# Altium schematic sheet PIC32MZ.SchDoc
size B; SheetNumber: 2; SheetTotal: 7
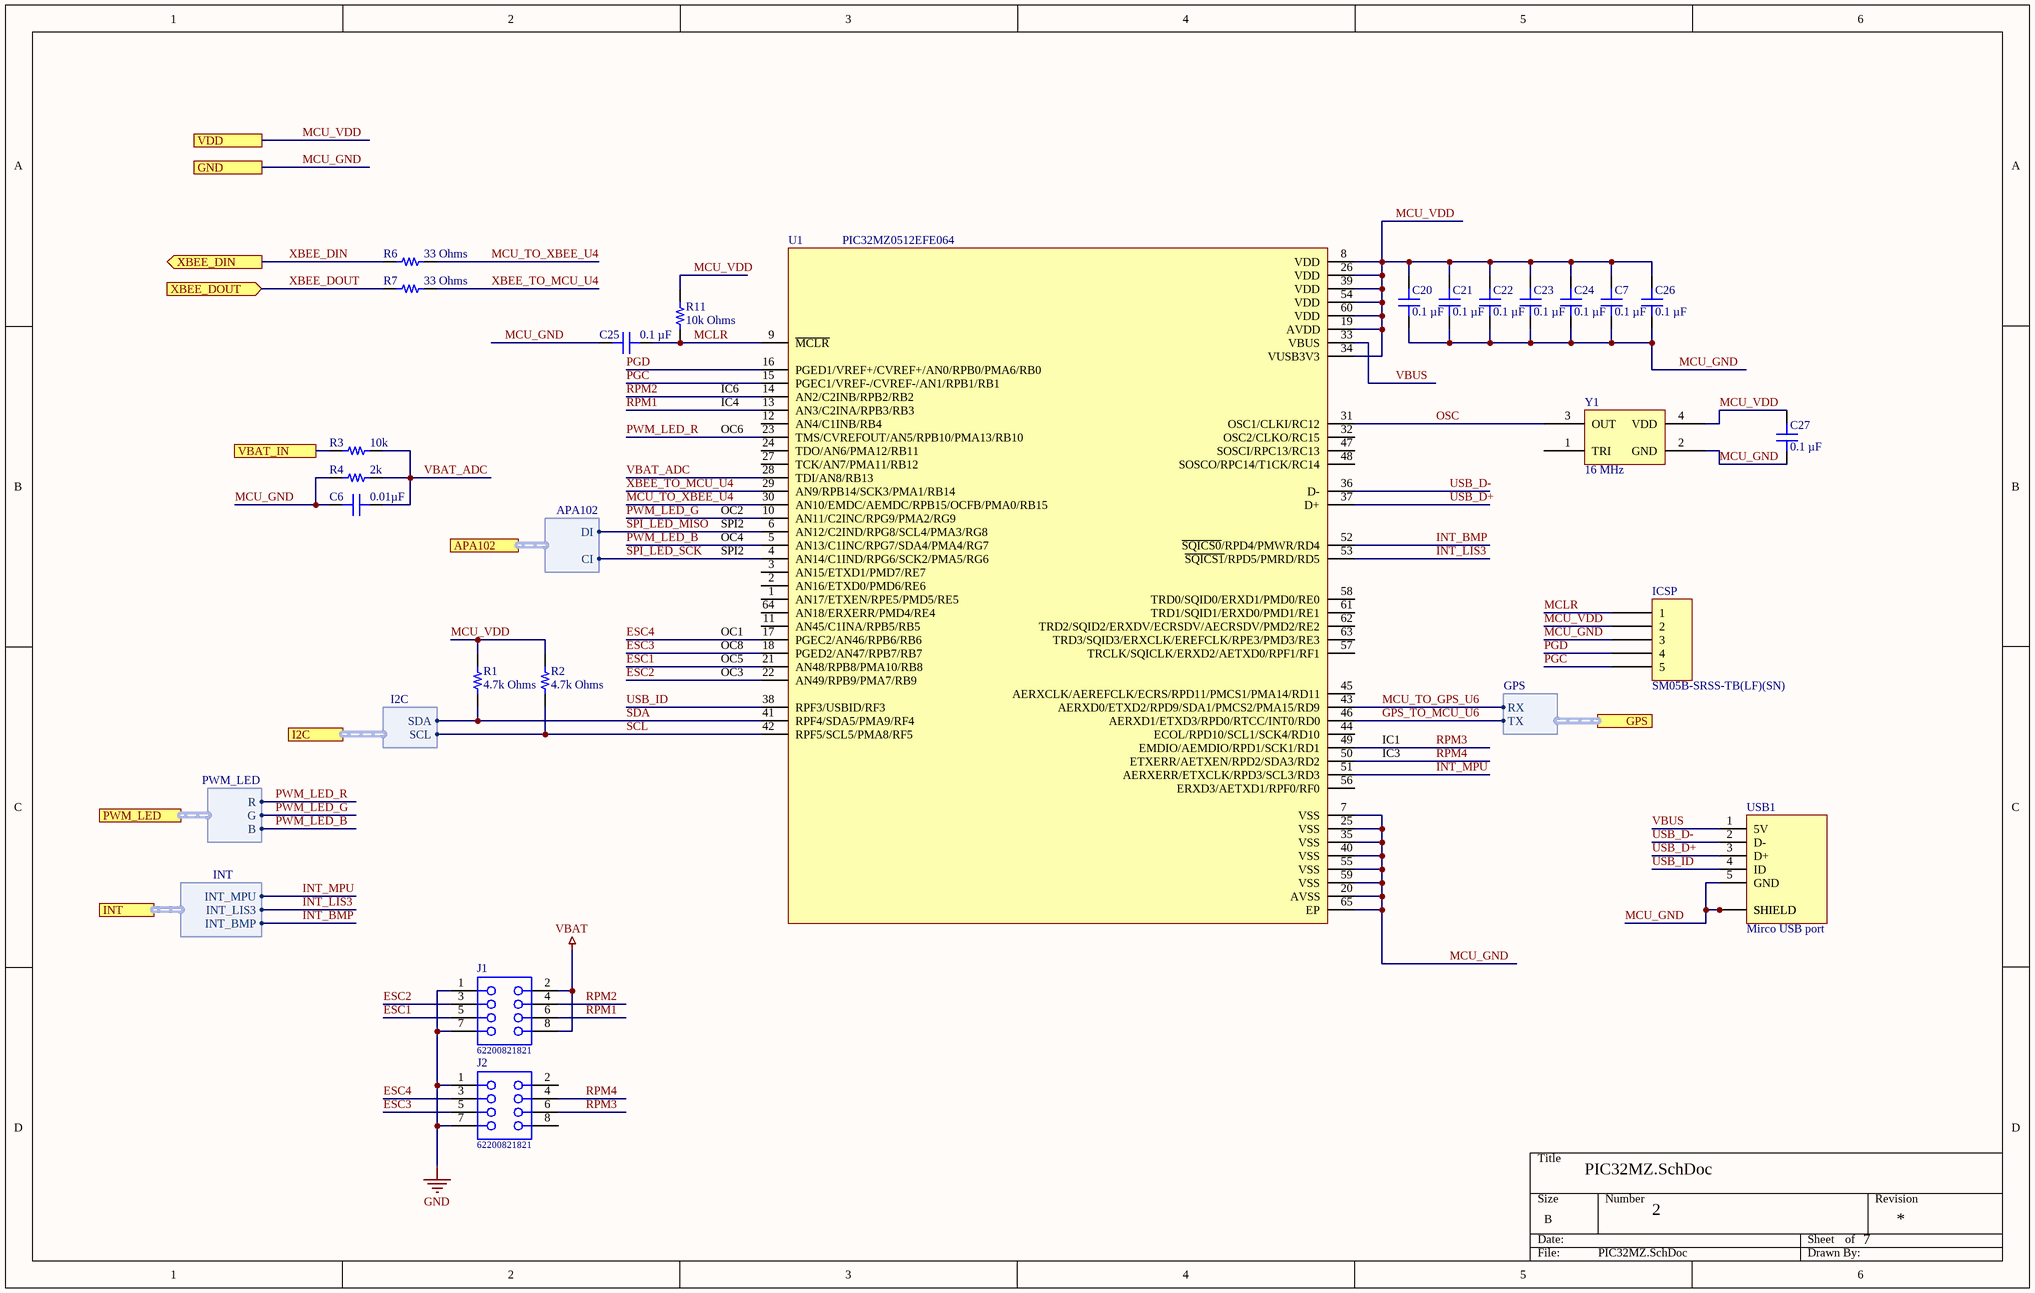
[diagram p0: PIC32MZ.SchDoc]

## Parts
C6  0.01µF  [CAP 0603_1608]
C7  0.1 µF  [CAP 0402_1005]
C20  0.1 µF  [CAP 0402_1005]
C21  0.1 µF  [CAP 0402_1005]
C22  0.1 µF  [CAP 0402_1005]
C23  0.1 µF  [CAP 0402_1005]
C24  0.1 µF  [CAP 0402_1005]
C25  0.1 µF  [CAP 0402_1005]
C26  0.1 µF  [CAP 0402_1005]
C27  0.1 µF  [CAP 0402_1005]
ICSP  SM05B-SRSS-TB(LF)(SN)  [JST SM05B-SRSS-TB]
J1  62200821821  [62200821821]
J2  62200821821  [62200821821]
R1  4.7k Ohms  [RES 0402_1005]
R2  4.7k Ohms  [RES 0402_1005]
R3  10k  [RES 0603_1608]
R4  2k  [RES 0603_1608]
R6  33 Ohms  [RES 0402_1005]
R7  33 Ohms  [RES 0402_1005]
R11  10k Ohms  [RES 0402_1005]
U1  PIC32MZ0512EFE064  [QFN50P900X900X100-65N]
USB1  Mirco USB port  [AMPHENOL_10118194-0001LF]
Y1  16 MHz  [ABRACON ASE]

## Ports
APA102 (harness APA102), GND, GPS (harness GPS), I2C (harness I2C), INT (harness INT), PWM_LED (harness PWM_LED), VBAT_IN, VDD, XBEE_DIN (out), XBEE_DOUT (in)

## Harnesses
I2C: SDA, SCL
APA102: DI, CI
GPS: RX, TX
PWM_LED: R, B, G
INT: INT_MPU, INT_BMP, INT_LIS3

## Nets
GND: J1.1 J1.7 J2.1 J2.7
VBAT: J1.2 J1.8
ESC1: J1.5 U1.21(AN48/RPB8/PMA10/RB8)
ESC2: J1.3 U1.22(AN49/RPB9/PMA7/RB9)
ESC3: J2.5 U1.18(PGED2/AN47/RPB7/RB7)
ESC4: J2.3 U1.17(PGEC2/AN46/RPB6/RB6)
GPS_TO_MCU_U6: U1.46(AERXD1/ETXD3/RPD0/RTCC/INT0/RD0) ; port GPS.TX
INT_BMP: U1.52(~{SQICS0}/RPD4/PMWR/RD4) ; port INT.INT_BMP
INT_LIS3: U1.53(~{SQICS1}/RPD5/PMRD/RD5) ; port INT.INT_LIS3
INT_MPU: U1.51(AERXERR/ETXCLK/RPD3/SCL3/RD3) ; port INT.INT_MPU
MCLR: C25.1 ICSP.1 R11.1 U1.9(~{MCLR})
MCU_GND: C6.2 C7.1 C20.1 C21.1 C22.1 C23.1 C24.1 C25.2 C26.1 C27.1 ICSP.3 R4.1 U1.7(VSS) U1.20(AVSS) U1.25(VSS) U1.35(VSS) U1.40(VSS) U1.55(VSS) U1.59(VSS) U1.65(EP) USB1.5(GND) USB1.S1(SHIELD) USB1.S2(SHIELD) USB1.S3(SHIELD) USB1.S4(SHIELD) USB1.S5(SHIELD) USB1.S6(SHIELD) Y1.2(GND) ; port GND
MCU_TO_GPS_U6: U1.43(AERXD0/ETXD2/RPD9/SDA1/PMCS2/PMA15/RD9) ; port GPS.RX
MCU_TO_XBEE_U4: R6.2 U1.30(AN10/EMDC/AEMDC/RPB15/OCFB/PMA0/RB15)
MCU_VDD: C7.2 C20.2 C21.2 C22.2 C23.2 C24.2 C26.2 C27.2 ICSP.2 R1.2 R2.2 R11.2 U1.8(VDD) U1.19(AVDD) U1.26(VDD) U1.34(VUSB3V3) U1.39(VDD) U1.54(VDD) U1.60(VDD) Y1.4(VDD) ; port VDD
OSC: U1.31(OSC1/CLKI/RC12) Y1.3(OUT)
PGC: ICSP.5 U1.15(PGEC1/VREF-/CVREF-/AN1/RPB1/RB1)
PGD: ICSP.4 U1.16(PGED1/VREF+/CVREF+/AN0/RPB0/PMA6/RB0)
PWM_LED_B: U1.5(AN13/C1INC/RPG7/SDA4/PMA4/RG7) ; port PWM_LED.B
PWM_LED_G: U1.10(AN11/C2INC/RPG9/PMA2/RG9) ; port PWM_LED.G
PWM_LED_R: U1.23(TMS/CVREFOUT/AN5/RPB10/PMA13/RB10) ; port PWM_LED.R
RPM1: J1.6 U1.13(AN3/C2INA/RPB3/RB3)
RPM2: J1.4 U1.14(AN2/C2INB/RPB2/RB2)
RPM3: J2.6 U1.49(EMDIO/AEMDIO/RPD1/SCK1/RD1)
RPM4: J2.4 U1.50(ETXERR/AETXEN/RPD2/SDA3/RD2)
SCL: R2.1 U1.42(RPF5/SCL5/PMA8/RF5) ; port I2C.SCL
SDA: R1.1 U1.41(RPF4/SDA5/PMA9/RF4) ; port I2C.SDA
SPI_LED_MISO: U1.6(AN12/C2IND/RPG8/SCL4/PMA3/RG8) ; port APA102.DI
SPI_LED_SCK: U1.4(AN14/C1IND/RPG6/SCK2/PMA5/RG6) ; port APA102.CI
USB_D+: U1.37(D+) USB1.3(D+)
USB_D-: U1.36(D-) USB1.2(D-)
USB_ID: U1.38(RPF3/USBID/RF3) USB1.4(ID)
VBAT_ADC: C6.1 R3.1 R4.2 U1.28(TDI/AN8/RB13)
VBAT_IN: R3.2 ; port VBAT_IN
VBUS: U1.33(VBUS) USB1.1(5V)
XBEE_DIN: R6.1 ; port XBEE_DIN
XBEE_DOUT: R7.1 ; port XBEE_DOUT
XBEE_TO_MCU_U4: R7.2 U1.29(AN9/RPB14/SCK3/PMA1/RB14)

Not connected (* = marked no-connect by the designer): J2 2 8; U1 1(AN17/ETXEN/RPE5/PMD5/RE5) 2(AN16/ETXD0/PMD6/RE6) 3(AN15/ETXD1/PMD7/RE7) 11(AN45/C1INA/RPB5/RB5) 12(AN4/C1INB/RB4) 24(TDO/AN6/PMA12/RB11) 27(TCK/AN7/PMA11/RB12) 32(OSC2/CLKO/RC15) 44(ECOL/RPD10/SCL1/SCK4/RD10) 45(AERXCLK/AEREFCLK/ECRS/RPD11/PMCS1/PMA14/RD11) 47(SOSCI/RPC13/RC13) 48(SOSCO/RPC14/T1CK/RC14) 56(ERXD3/AETXD1/RPF0/RF0) 57(TRCLK/SQICLK/ERXD2/AETXD0/RPF1/RF1) 58(TRD0/SQID0/ERXD1/PMD0/RE0) 61(TRD1/SQID1/ERXD0/PMD1/RE1) 62(TRD2/SQID2/ERXDV/ECRSDV/AECRSDV/PMD2/RE2) 63(TRD3/SQID3/ERXCLK/EREFCLK/RPE3/PMD3/RE3) 64(AN18/ERXERR/PMD4/RE4); Y1 1(TRI)

## Notes on the sheet
- (near U1) IC4
- IC6
- (near U1) OC6
- (near U1) SPI2
- (near U1) OC2
- (near U1) OC4
- (near U1) OC1
- (near U1) OC5
- (near U1) OC3
- (near U1) OC8
- IC1
- IC3

## Library data of the parts
C6 = GCG188R92A104KA03D: CAP CER 0.1UF 100V 0603 EPOXY; Manufacturer: Murata Electronics; Capacitance: 0.1µF; Temperature Coefficient: X8R; Tolerance: ±10%; Part Number: GCG188R92A104KA03D; Value: 0.01µF; Applications: Automotive; ComponentLink1Description: Datasheet; ComponentLink1URL: https://search.murata.co.jp/Ceramy/image/img/A01X/G101/ENG/GCG188R92A104KA03-01.pdf; ComponentLink2Description: DigiKey Link; ComponentLink2URL: http://digikey.com/product-detail/en/murata-electronics/GCG188R92A104KA03D/490-18197-1-ND/9867926; Device Package: 0603 (1608 Metric); Features: Epoxy Mountable; LastUpdated: 21-Jan-20 12:01:59 AM; Lifecycle Status: Active; Minimum Order: 1; Mounting Type: Surface Mount, MLCC, Epoxy; Operating Temperature: -55°C ~ 150°C; Package / Case: 0603 (1608 Metric); Packaging: TapeAndReel; PartId: 9025; Part Status: Active; Price: 0.07; Ratings: AEC-Q200; Series: GCG; Size / Dimension: 0.063" L x 0.031" W (1.60mm x 0.80mm); Supplier 1: DigiKey; Supplier Part Number 1: 490-18197-1-ND; Thickness (Max): 0.035" (0.90mm); Voltage - Rated: 100V
C7 C20-C27 = C0402C104K4RACAUTO: CAP CER 0.1UF 16V X7R 0402; manufacturer: KEMET; Tolerance: ±10%; Part Number: C0402C104K4RACAUTO; Value: 0.1 µF; Applications: Automotive, Bypass, Decoupling; Capacitance: 0.1 µF; componentlink1description: Datasheet; componentlink1url: https://api.kemet.com/component-edge/download/specsheet/C0402C104K4RACAUTO.pdf; componentlink2description: DigiKey Link; componentlink2url: https://www.digikey.com/en/products/detail/kemet/C0402C104K4RACAUTO/3314827; Device Package: 0402 (1005 Metric); lastupdated: 8/14/2022 9:05:51 PM; Lifecycle Status: Active; Minimum Order: 1; Mounting Type: Surface Mount, MLCC; Operating Temperature: -55°C ~ 125°C; Package / Case: 0402 (1005 Metric); packaging: TapeAndReel; partid: 3024; Part Status: Active; price: 0.01; Ratings: AEC-Q200; series: SMD Auto X7R; Size / Dimension: 0.039" L x 0.020" W (1.00mm x 0.50mm); Supplier 1: DigiKey; Supplier Part Number 1: 399-6828-1-ND; Temperature Coefficient: X7R; Thickness (Max): 0.022" (0.55mm); Voltage - Rated: 16V
ICSP = SM05B-SRSS-TB(LF)(SN): CONN HEADER SMD R/A 5POS 1MM; Manufacturer: JST Sales America Inc.; Current Rating (Amps): 0.7A; Material Flammability Rating: UL94 V-0; Number of Positions: 5; Number of Positions Loaded: All; Pitch - Mating: 0.039" (1.00mm); Shrouding: Shrouded - 4 Wall; Style: Board to Cable/Wire; Voltage Rating: 50V; Part Number: SM05B-SRSS-TB(LF)(SN); ComponentLink1Description: Datasheet; ComponentLink1URL: http://www.jst-mfg.com/product/pdf/eng/eSH.pdf; ComponentLink2Description: DigiKey Link; ComponentLink2URL: http://digikey.com/product-detail/en/jst-sales-america-inc/SM05B-SRSS-TB-LF-SN/455-1805-1-ND/926876; Connector Type: Header; Contact Finish - Mating: Tin; Contact Finish - Post: Tin; Contact Material: Copper Alloy; Contact Shape: Square; Contact Type: Male Pin; Fastening Type: Push-Pull; Features: Solder Retention; Insulation Color: Natural; Insulation Height: 0.114" (2.90mm); Insulation Material: Polyamide (PA), Nylon; LastUpdated: 1/12/2020 11:42:04 PM; Lifecycle Status: Active; Minimum Order: 1; Mounting Type: Surface Mount, Right Angle; Number of Rows: 1; Operating Temperature: -25°C ~ 85°C; Packaging: TapeAndReel; PartId: 63; Part Status: Active; Price: 0.32; Series: SR; Supplier 1: DigiKey; Supplier Part Number 1: 455-1805-1-ND; Termination: Solder
J1 J2 = 62200821821: WR-PHD Socket Header, THT, pitch 1.27mm, Dual Row, Vertical, 8p; Manufacturer: Wurth Elektronik; Pin Number: 8; Rated Current: 1A; Working Voltage: 250VAC; Withstanding Voltage: 500VAC; Contact Resistance: 20mOhm; System: Connector; ComponentLink1Description: Manufacturer; ComponentLink1URL: http://www.we-online.de; ComponentLink2Description: Datasheet; ComponentLink2URL: https://www.we-online.com/catalog/datasheet/62200821821.pdf; Manufacturer Part Number: 62200821821; Published Date: May 2020; Pitch: 1.27mm; Operating Temperature: -40 to +105degC; Mounting Technology: THT; Packaging: Tube; Gender: Socket Header; Row Number: Dual; Orientation: Vertical
R1 R2 R6 R7 R11 = CRCW0402330RJNEDC: RES 330 OHM 5% 1/16W 0402; Manufacturer: Vishay Dale; Power (Watts): 0.063W, 1/16W; Resistance: 330 Ohms; Temperature Coefficient: ±200ppm/°C; Part Number: CRCW0402330RJNEDC; ComponentLink1Description: Datasheet; ComponentLink1URL: http://www.vishay.com/docs/28773/crcwce3.pdf; ComponentLink2Description: DigiKey Link; ComponentLink2URL: https://www.digikey.com/en/products/detail/vishay-dale/CRCW0402330RJNEDC/7928545; Composition: Thick Film; Device Package: 0402 (1005 Metric); Height - Seated (Max): 0.014" (0.35mm); LastUpdated: 8/14/2022 9:23:31 PM; Lifecycle Status: Active; Minimum Order: 1; Number of Terminations: 2; Operating Temperature: -55°C ~ 155°C; Package / Case: 0402 (1005 Metric); Packaging: CutTape; PartId: 15989; Part Status: Active; Price: 0.01; Series: CRCW-C; Size / Dimension: 0.039" L x 0.020" W (1.00mm x 0.50mm); Supplier 1: DigiKey; Supplier Part Number 1: 541-4123-1-ND; Supplier Device Package: 0402; Tolerance: ±5%
  R1 R2: Value: 4.7k Ohms
  R6 R7: Value: 33 Ohms
  R11: Value: 10k Ohms
R3 R4 = ERJ-3EKF21R5V: RES SMD 21.5 OHM 1% 1/10W 0603; Manufacturer: Panasonic Electronic Components; Power (Watts): 0.1W, 1/10W; Resistance: 21.5 Ohms; Temperature Coefficient: ±100ppm/°C; Part Number: ERJ-3EKF21R5V; ComponentLink1Description: Datasheet; ComponentLink1URL: https://industrial.panasonic.com/cdbs/www-data/pdf/RDA0000/AOA0000C304.pdf; ComponentLink2Description: DigiKey Link; ComponentLink2URL: http://digikey.com/product-detail/en/panasonic-electronic-components/ERJ-3EKF21R5V/P21.5HCT-ND/198246; Composition: Thick Film; Device Package: 0603 (1608 Metric); Features: Automotive AEC-Q200; Height - Seated (Max): 0.022" (0.55mm); LastUpdated: 21-Jan-20 12:16:19 AM; Lifecycle Status: Active; Minimum Order: 1; Number of Terminations: 2; Operating Temperature: -55°C ~ 155°C; Package / Case: 0603 (1608 Metric); Packaging: TapeAndReel; PartId: 24202; Part Status: Active; Price: 0.01; Ratings: AEC-Q200; Series: ERJ; Size / Dimension: 0.063" L x 0.031" W (1.60mm x 0.80mm); Supplier 1: DigiKey; Supplier Part Number 1: P21.5HCT-ND; Supplier Device Package: 0603; Tolerance: ±1%
  R3: Value: 10k
  R4: Value: 2k
U1 = PIC32MZ0512EFE064-I/PT: 32-bit Microcontrollers - MCU 32-BIT MCU 512KB FL 128KB RAM, No Crypto; MF: Microchip; MP: PIC32MZ2048EFG064T-I/PT; Price: None; Value: *; SnapEDA_Link: https://www.snapeda.com/parts/PIC32MZ2048EFG064T-I/PT/Microchip/view-part/565997/?ref=snap; Package: TQFP-64 Microchip; Availability: Unavailable
USB1 = 10118194-0001LF: USB - micro B USB 2.0 Receptacle Connector 5 Position Surface Mount, Right Angle; Through Hole; MF: Amphenol ICC; Package: None; Price: None; Availability: Unavailable; MP: 10118194-0001LF; SnapEDA_Link: https://www.snapeda.com/parts/10118194-0001LF/Amphenol%20FCI/view-part/1413308/?ref=snap; Value: *
Y1 = ASE-16.000MHZ-LC-T: XTAL OSC XO 16.000MHZ CMOS SMD; Manufacturer: Abracon LLC; Base Resonator: Crystal; Current - Supply (Max): 7mA; Frequency Stability: ±50ppm; Function: Enable/Disable; Voltage - Supply: 3.3V; Part Number: ASE-16.000MHZ-LC-T; ComponentLink1Description: Datasheet; ComponentLink1URL: https://abracon.com/Oscillators/ASEseries.pdf; ComponentLink2Description: DigiKey Link; ComponentLink2URL: https://www.digikey.com/en/products/detail/abracon-llc/ASE-16-000MHZ-LC-T/15995942; Frequency: 16 MHz; Height - Seated (Max): 0.047" (1.20mm); LastUpdated: 8/26/2022 12:10:14 PM; Lifecycle Status: Active; Minimum Order: 1; Mounting Type: Surface Mount; Operating Temperature: -40°C ~ 85°C; Output: CMOS; Packaging: TapeAndReel; PartId: 272; Part Status: Active; Price: 1.26; Series: ASE; Size / Dimension: 0.126" L x 0.098" W (3.20mm x 2.50mm); Supplier 1: DigiKey; Supplier Part Number 1: 535-ASE-16.000MHZ-LC-TCT-ND; Type: XO (Standard); Value: 16 MHz